# Altium schematic sheet NIXIE_Mainboard.SchDoc
size A3
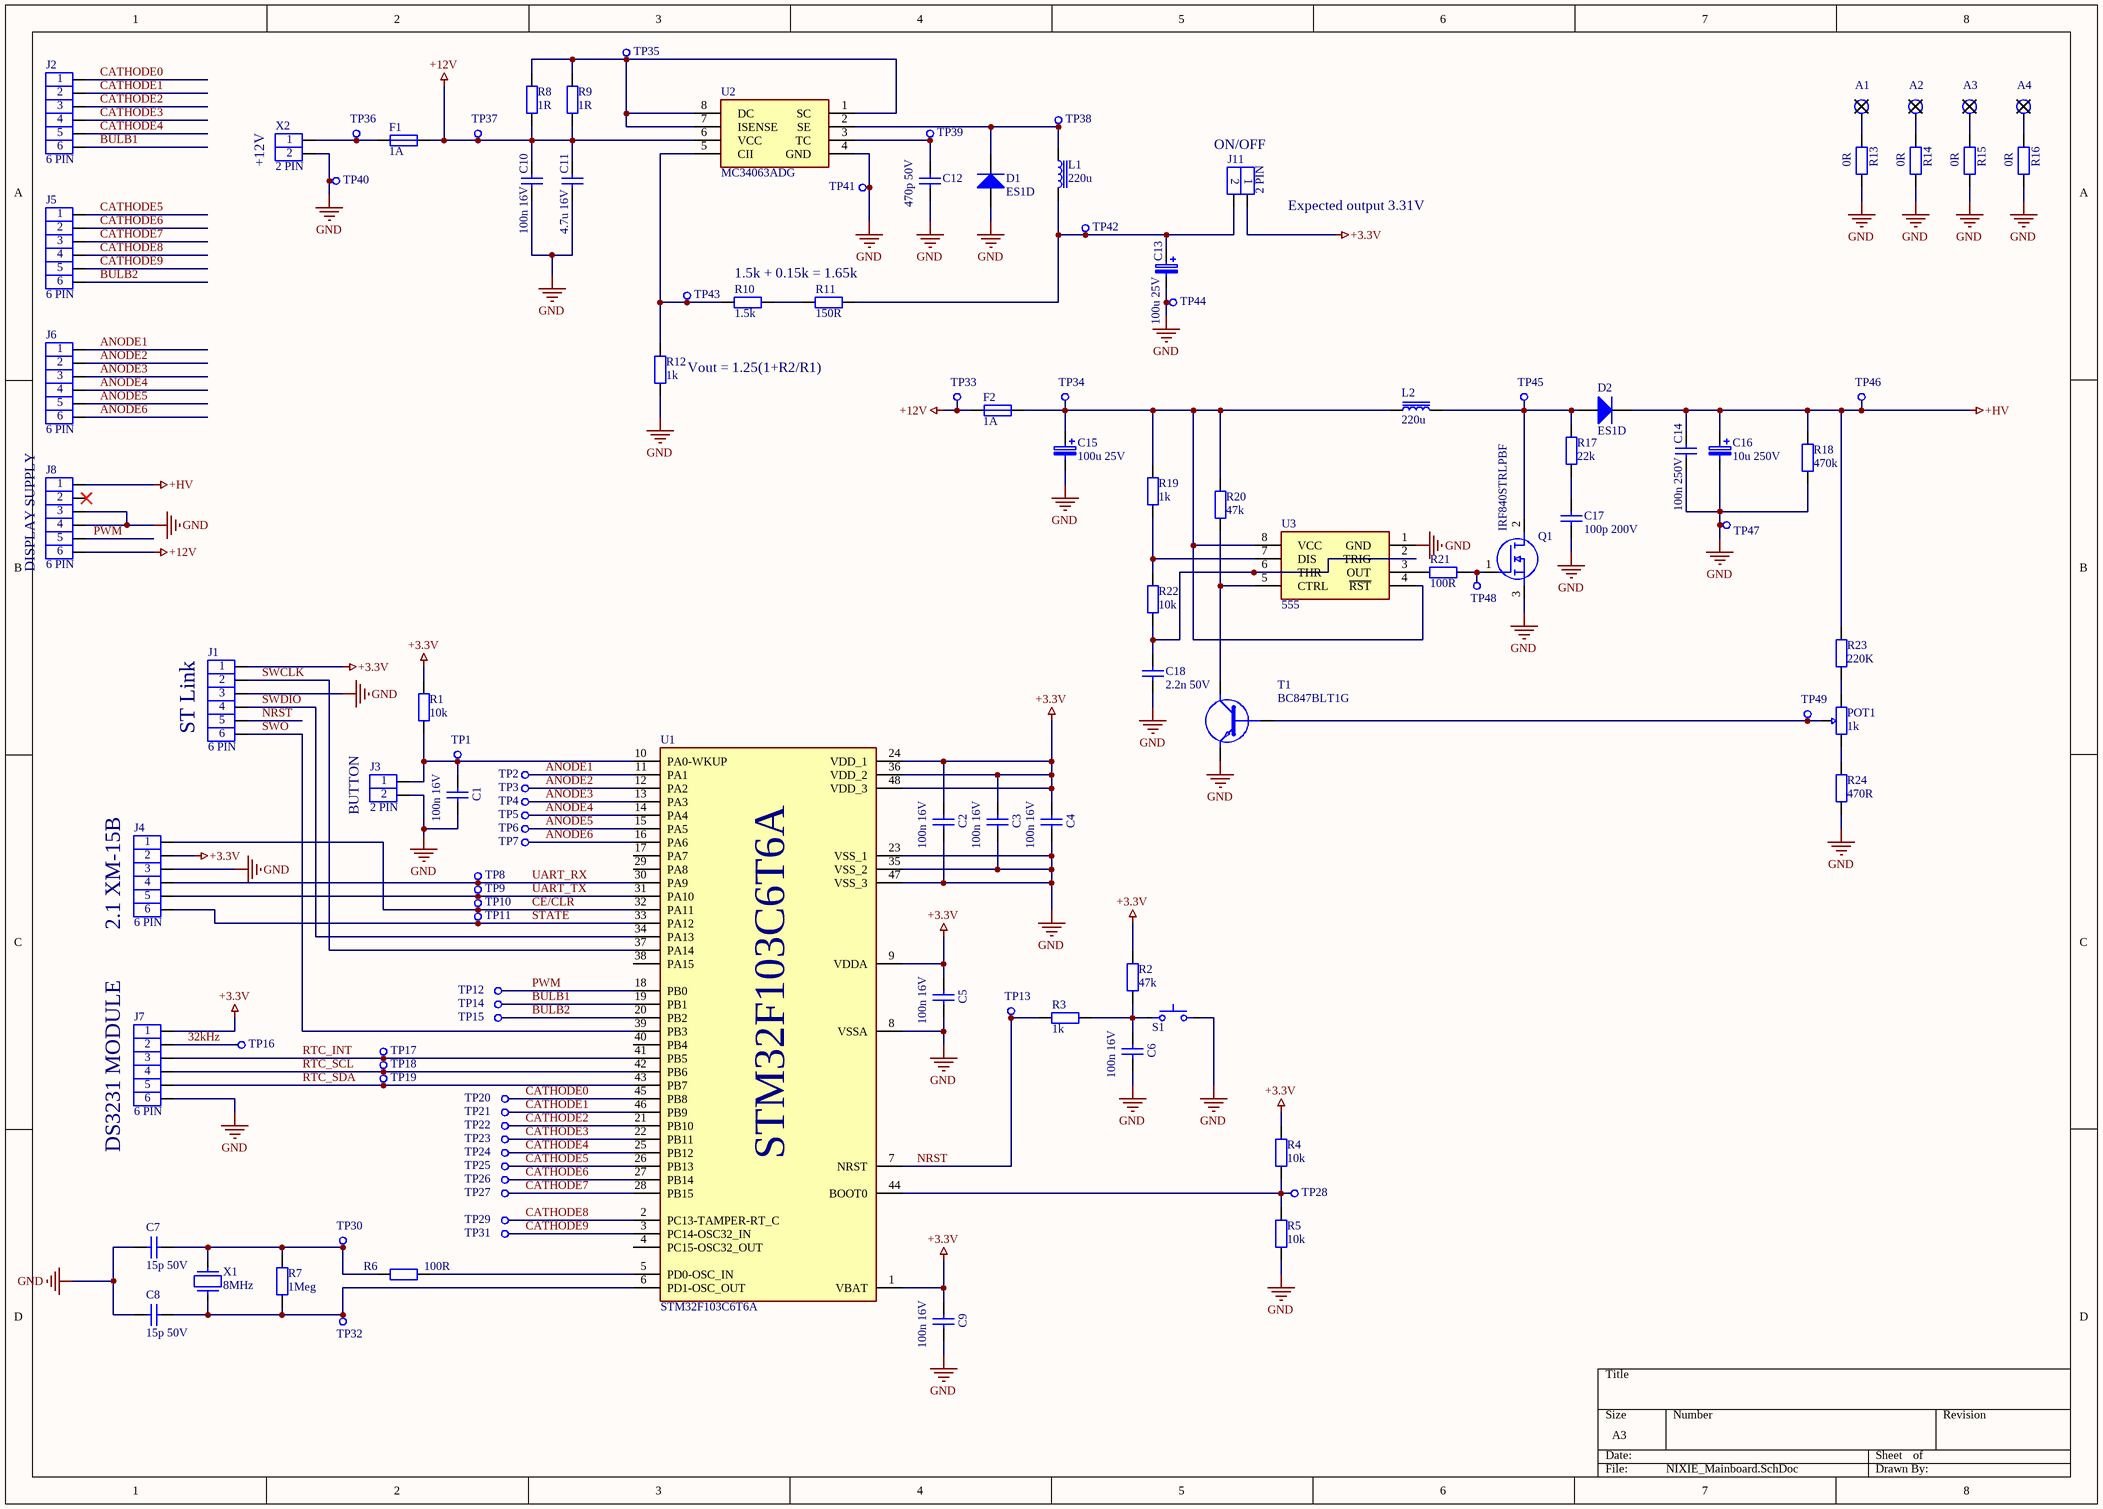
[diagram p0: NIXIE_Mainboard.SchDoc]

## Parts
A1  3mm  [HOLE M3]  (value not drawn)
A2  3mm  [HOLE M3]  (value not drawn)
A3  3mm  [HOLE M3]  (value not drawn)
A4  3mm  [HOLE M3]  (value not drawn)
C1  100n 16V  [CAPACITOR 0603]
C2  100n 16V  [CAPACITOR 0603]
C3  100n 16V  [CAPACITOR 0603]
C4  100n 16V  [CAPACITOR 0603]
C5  100n 16V  [CAPACITOR 0603]
C6  100n 16V  [CAPACITOR 0603]
C7  15p 50V  [CAPACITOR 0603]
C8  15p 50V  [CAPACITOR 0603]
C9  100n 16V  [CAPACITOR 0603]
C10  100n 16V  [CAPACITOR 0603]
C11  4.7u 16V  [CAPACITOR 0805]
C12  470p 50V  [CAPACITOR 0603]
C13  100u 25V  [CAPACITOR 6.3X11MM THT]
C14  100n 250V  [CAPACITOR 1206]
C15  100u 25V  [CAPACITOR 6.3X11MM THT]
C16  10u 250V  [CAPACITOR 10X20MM THT]
C17  100p 200V  [CAPACITOR 1206]
C18  2.2n 50V  [CAPACITOR 0603]
D1  ES1D  [DIODE DO-214AC]
D2  ES1D  [DIODE DO-214AC]
F1  1A  [FUSE 1206]
F2  1A  [FUSE 1206]
J1  6 PIN  [MECHANICAL PINHEADER 6P 2.54MM MALE]
J2  6 PIN  [MECHANICAL PINHEADER 6P 2.54MM MALE]
J3  2 PIN  [MECHANICAL PINHEADER 2P 2.54MM MALE]
J4  6 PIN  [MECHANICAL PINHEADER 6P 2.54MM MALE]
J5  6 PIN  [MECHANICAL PINHEADER 6P 2.54MM MALE]
J6  6 PIN  [MECHANICAL PINHEADER 6P 2.54MM MALE]
J7  6 PIN  [MECHANICAL PINHEADER 6P 2.54MM MALE]
J8  6 PIN  [MECHANICAL PINHEADER 6P 2.54MM MALE]
J11  2 PIN  [MECHANICAL PINHEADER 2P 2.54MM MALE]
L1  220u  [INDUCTOR CDRH127]
L2  220u  [INDUCTOR CDRH127]
POT1  1k  [POTENTIOMETER TC33X]
Q1  IRF840STRLPBF  [TO-263-3]
R1  10k  [RESISTOR 0603]
R2  47k  [RESISTOR 0603]
R3  1k  [RESISTOR 0603]
R4  10k  [RESISTOR 0603]
R5  10k  [RESISTOR 0603]
R6  100R  [RESISTOR 0603]
R7  1Meg  [RESISTOR 0603]
R8  1R  [RESISTOR 1206]
R9  1R  [RESISTOR 1206]
R10  1.5k  [RESISTOR 0603]
R11  150R  [RESISTOR 0603]
R12  1k  [RESISTOR 0603]
R13  0R  [RESISTOR 0603]
R14  0R  [RESISTOR 0603]
R15  0R  [RESISTOR 0603]
R16  0R  [RESISTOR 0603]
R17  22k  [RESISTOR 1206]
R18  470k  [RESISTOR 1206]
R19  1k  [RESISTOR 0603]
R20  47k  [RESISTOR 0603]
R21  100R  [RESISTOR 0603]
R22  10k  [RESISTOR 0603]
R23  220K  [RESISTOR 1206]
R24  470R  [RESISTOR 0603]
S1  6x6mm  [MECHANICAL TACTSWITCH SMD 6x6]  (value not drawn)
T1  BC847BLT1G  [SOT23-3]
TP1  1mm  [TEST POINT 1MM]  (value not drawn)
TP2  1mm  [TEST POINT 1MM]  (value not drawn)
TP3  1mm  [TEST POINT 1MM]  (value not drawn)
TP4  1mm  [TEST POINT 1MM]  (value not drawn)
TP5  1mm  [TEST POINT 1MM]  (value not drawn)
TP6  1mm  [TEST POINT 1MM]  (value not drawn)
TP7  1mm  [TEST POINT 1MM]  (value not drawn)
TP8  1mm  [TEST POINT 1MM]  (value not drawn)
TP9  1mm  [TEST POINT 1MM]  (value not drawn)
TP10  1mm  [TEST POINT 1MM]  (value not drawn)
TP11  1mm  [TEST POINT 1MM]  (value not drawn)
TP12  1mm  [TEST POINT 1MM]  (value not drawn)
TP13  1mm  [TEST POINT 1MM]  (value not drawn)
TP14  1mm  [TEST POINT 1MM]  (value not drawn)
TP15  1mm  [TEST POINT 1MM]  (value not drawn)
TP16  1mm  [TEST POINT 1MM]  (value not drawn)
TP17  1mm  [TEST POINT 1MM]  (value not drawn)
TP18  1mm  [TEST POINT 1MM]  (value not drawn)
TP19  1mm  [TEST POINT 1MM]  (value not drawn)
TP20  1mm  [TEST POINT 1MM]  (value not drawn)
TP21  1mm  [TEST POINT 1MM]  (value not drawn)
TP22  1mm  [TEST POINT 1MM]  (value not drawn)
TP23  1mm  [TEST POINT 1MM]  (value not drawn)
TP24  1mm  [TEST POINT 1MM]  (value not drawn)
TP25  1mm  [TEST POINT 1MM]  (value not drawn)
TP26  1mm  [TEST POINT 1MM]  (value not drawn)
TP27  1mm  [TEST POINT 1MM]  (value not drawn)
TP28  1mm  [TEST POINT 1MM]  (value not drawn)
TP29  1mm  [TEST POINT 1MM]  (value not drawn)
TP30  1mm  [TEST POINT 1MM]  (value not drawn)
TP31  1mm  [TEST POINT 1MM]  (value not drawn)
TP32  1mm  [TEST POINT 1MM]  (value not drawn)
TP33  1mm  [TEST POINT 1MM]  (value not drawn)
TP34  1mm  [TEST POINT 1MM]  (value not drawn)
TP35  1mm  [TEST POINT 1MM]  (value not drawn)
TP36  1mm  [TEST POINT 1MM]  (value not drawn)
TP37  1mm  [TEST POINT 1MM]  (value not drawn)
TP38  1mm  [TEST POINT 1MM]  (value not drawn)
TP39  1mm  [TEST POINT 1MM]  (value not drawn)
TP40  1mm  [TEST POINT 1MM]  (value not drawn)
TP41  1mm  [TEST POINT 1MM]  (value not drawn)
TP42  1mm  [TEST POINT 1MM]  (value not drawn)
TP43  1mm  [TEST POINT 1MM]  (value not drawn)
TP44  1mm  [TEST POINT 1MM]  (value not drawn)
TP45  1mm  [TEST POINT 1MM]  (value not drawn)
TP46  1mm  [TEST POINT 1MM]  (value not drawn)
TP47  1mm  [TEST POINT 1MM]  (value not drawn)
TP48  1mm  [TEST POINT 1MM]  (value not drawn)
TP49  1mm  [TEST POINT 1MM]  (value not drawn)
U1  STM32F103C6T6A  [LQFP-48]
U2  MC34063ADG  [SOIC-8]
U3  555  [SOIC-8]
X1  8MHz  [OSCILLATOR 8MHZ SMD]
X2  2 PIN  [MECHANICAL ARK KF301 2PIN]

## Nets
+3.3V: C2.2 C3.2 C4.2 C5.2 C9.2 J1.1 J4.2 J7.1 J11.1 R1.2 R2.2 R4.2 U1.1(VBAT) U1.9(VDDA) U1.24(VDD_1) U1.36(VDD_2) U1.48(VDD_3)
+12V: C10.2 C11.2 F1.2 F2.1 J8.6 R8.1 R9.1 TP33.1 TP37.1 U2.6(VCC)
+HV: C14.2 C16.1 D2.2 J8.1 R18.2 R23.2 TP46.1
GND: C1.1 C2.1 C3.1 C4.1 C5.1 C6.1 C7.1 C8.1 C9.1 C10.1 C11.1 C12.1 C13.2 C14.1 C15.2 C16.2 C17.1 C18.1 D1.1 J1.3 J3.2 J4.3 J7.6 J8.3 J8.4 Q1.3(S) R5.1 R12.1 R13.1 R14.1 R15.1 R16.1 R18.1 R24.1 S1.2 T1.2(E) TP40.1 TP41.1 TP44.1 TP47.1 U1.8(VSSA) U1.23(VSS_1) U1.35(VSS_2) U1.47(VSS_3) U2.4(GND) U3.1(GND) X2.2
32kHz: J7.2 TP16.1
ANODE1: J6.1 TP2.1 U1.11(PA1)
ANODE2: J6.2 TP3.1 U1.12(PA2)
ANODE3: J6.3 TP4.1 U1.13(PA3)
ANODE4: J6.4 TP5.1 U1.14(PA4)
ANODE5: J6.5 TP6.1 U1.15(PA5)
ANODE6: J6.6 TP7.1 U1.16(PA6)
BULB1: J2.6 TP14.1 U1.19(PB1)
BULB2: J5.6 TP15.1 U1.20(PB2)
CATHODE0: J2.1 TP20.1 U1.45(PB8)
CATHODE1: J2.2 TP21.1 U1.46(PB9)
CATHODE2: J2.3 TP22.1 U1.21(PB10)
CATHODE3: J2.4 TP23.1 U1.22(PB11)
CATHODE4: J2.5 TP24.1 U1.25(PB12)
CATHODE5: J5.1 TP25.1 U1.26(PB13)
CATHODE6: J5.2 TP26.1 U1.27(PB14)
CATHODE7: J5.3 TP27.1 U1.28(PB15)
CATHODE8: J5.4 TP29.1 U1.2(PC13-TAMPER-RT_C)
CATHODE9: J5.5 TP31.1 U1.3(PC14-OSC32_IN)
CE/CLR: J4.1 TP10.1 U1.32(PA11)
NRST: J1.5 R3.2 TP13.1 U1.7(NRST)
PWM: J8.5 TP12.1 U1.18(PB0)
RTC_INT: J7.3 TP17.1 U1.41(PB5)
RTC_SCL: J7.4 TP18.1 U1.42(PB6)
RTC_SDA: J7.5 TP19.1 U1.43(PB7)
STATE: J4.6 TP11.1 U1.33(PA12)
SWCLK: J1.2 U1.37(PA14)
SWDIO: J1.4 U1.34(PA13)
SWO: J1.6 U1.39(PB3)
UART_RX: J4.4 TP8.1 U1.30(PA9)
UART_TX: J4.5 TP9.1 U1.31(PA10)
NetA1_1: A1.1 R13.2
NetA2_1: A2.1 R14.2
NetA3_1: A3.1 R15.2
NetA4_1: A4.1 R16.2
NetC1_2: C1.2 J3.1 R1.1 TP1.1 U1.10(PA0-WKUP)
NetC6_2: C6.2 R2.1 R3.1 S1.1
NetC7_2: C7.2 R6.1 R7.2 TP30.1 X1.2
NetC8_2: C8.2 R7.1 TP32.1 U1.6(PD1-OSC_OUT) X1.1
NetC12_2: C12.2 TP39.1 U2.3(TC)
NetC13_1: C13.1 J11.2 L1.1 R11.2 TP42.1
NetC15_1: C15.1 F2.2 L2.1 R19.2 R20.2 TP34.1 U3.4(~{RST}) U3.8(VCC)
NetC17_2: C17.2 R17.1
NetC18_2: C18.2 R22.1 U3.2(TRIG) U3.6(THR)
NetD1_2: D1.2 L1.2 TP38.1 U2.2(SE)
NetD2_1: D2.1 L2.2 Q1.2(D) R17.2 TP45.1
NetF1_1: F1.1 TP36.1 X2.1
NetPOT1_1: POT1.1 R23.1
NetPOT1_2: POT1.2 T1.1(B) TP49.1
NetPOT1_3: POT1.3 R24.2
NetQ1_1: Q1.1(G) R21.2 TP48.1
NetR4_1: R4.1 R5.2 TP28.1 U1.44(BOOT0)
NetR6_2: R6.2 U1.5(PD0-OSC_IN)
NetR8_2: R8.2 R9.2 TP35.1 U2.1(SC) U2.7(ISENSE) U2.8(DC)
NetR10_1: R10.1 R12.2 TP43.1 U2.5(CII)
NetR10_2: R10.2 R11.1
NetR19_1: R19.1 R22.2 U3.7(DIS)
NetR20_1: R20.1 T1.3(C) U3.5(CTRL)
NetR21_1: R21.1 U3.3(OUT)

Not connected (* = marked no-connect by the designer): J8 2*; U1 4(PC15-OSC32_OUT) 17(PA7) 29(PA8) 38(PA15) 40(PB4)

## Notes on the sheet
- (near X2) +12V
- (near J11) ON/OFF
- (near J11) Expected output 3.31V
- 1.5k + 0.15k = 1.65k
- (near R12) Vout = 1.25(1+R2/R1)
- (near J8) DISPLAY SUPPLY
- (near J1) ST Link
- (near J3) BUTTON
- (near J4) 2.1 XM-15B
- (near J7) DS3231 MODULE

## Library data of the parts
A1-A4 = Mechanical M3 Hole: ComponentLink1Description: Datasheet; ComponentLink1URL: -; Manufacturer: -; Manufacturer Part Number: -; Footprint: -; Price 10pcs [$]: -; Supplier: -
C1-C6 C9 C10 = Capacitor 100n 16V 10% X7R 0603: Multilayer Ceramic Capacitors MLCC - SMD/SMT 0603 16VDC 0.1uF 10% X7R; Manufacturer: Taiyo Yuden; Manufacturer Part Number: EMK107B7104KA-T; ComponentLink1Description: Datasheet; ComponentLink1URL: https://www.mouser.pl/datasheet/2/396/mlcc02_e-1307760.pdf; Footprint: Capacitor 0603; Price 10pcs [$]: 0.016; Supplier: Mouser
C7 C8 = Capacitor 15p 50V 10% X7R 0603: Multilayer Ceramic Capacitors MLCC - SMD/SMT 50 V 15 pF C0G 0603 5%; Manufacturer: YAGEO; Manufacturer Part Number: CC0603JPNPO9BN150; ComponentLink1Description: Datasheet; ComponentLink1URL: https://www.mouser.pl/datasheet/2/447/UPY_NP0X5R_01005_4V_to_25V_V10-3003057.pdf; Footprint: Capacitor 0603; Price 10pcs [$]: 0.024; Supplier: Mouser
C11 = Capacitor 4.7u 16V 10% X7R 0805: Multilayer Ceramic Capacitors MLCC - SMD/SMT 0805 16VDC 4.7uF 10% X7R; Manufacturer: Taiyo Yuden; Manufacturer Part Number: EMK212B7475KG-T; ComponentLink1Description: Datasheet; ComponentLink1URL: https://www.mouser.pl/datasheet/2/396/mlcc02_e-1307760.pdf; Footprint: Capacitor 0805; Price 10pcs [$]: 0.114; Supplier: Mouser
C12 = Capacitor 470p 50V 10% X7R 0603: Multilayer Ceramic Capacitors MLCC - SMD/SMT 470p +-10% 16VX7R; Manufacturer: Walsin; Manufacturer Part Number: CC0603KPX7R9BB471; ComponentLink1Description: Datasheet; ComponentLink1URL: https://www.mouser.pl/datasheet/2/447/UPY_NP0X5R_01005_4V_to_25V_V10-3003057.pdf; Footprint: Capacitor 0603; Price 10pcs [$]: 0.065; Supplier: Mouser
C13 C15 = Capacitor 100u 25V 20% Aluminum 6.3x11mm THT: Aluminum Electrolytic Capacitors - Radial Leaded 25V 100uF 105C 6.3x11mm; Manufacturer: Lelon; Manufacturer Part Number: RGA101M1EBK-0611G; ComponentLink1Description: Datasheet; ComponentLink1URL: https://www.mouser.pl/datasheet/2/231/161587830771-2307470.pdf; Footprint: Capacitor 6.3x11mm THT; Price 10pcs [$]: 0.119; Supplier: Mouser
C14 = Capacitor 100n 250V 5% X7R 1206: Multilayer Ceramic Capacitors MLCC - SMD/SMT 250V 1000pF X7R 1206 5% Flex Term; Manufacturer: KEMET; Manufacturer Part Number: C1206X102JARACTU; ComponentLink1Description: Datasheet; ComponentLink1URL: https://www.mouser.pl/datasheet/2/212/KEM_C1011_X7R_TIP_RING_SMD-1103951.pdf; Footprint: Capacitor 1206; Price 10pcs [$]: 0.532; Supplier: Mouser
C16 = Capacitor 10u 250V 20% Aluminum 10x20mm THT: Aluminum Electrolytic Capacitors - Radial Leaded 25V 100uF 105C 6.3x11mm; Manufacturer: Producent; Manufacturer Part Number: PJ2E100MNN1020; ComponentLink1Description: Datasheet; ComponentLink1URL: https://www.tme.eu/Document/f817dd3cf02528febed7ff40ffb84e0e/PART-NUMBER-SYSTEM.pdf; Price 10pcs [$]: 0.215; Supplier: TME
C17 = Capacitor 100p 200V 10% X7R 1206: Multilayer Ceramic Capacitors MLCC - SMD/SMT 200V 100pF X7R 1206 10% AEC-Q200; Manufacturer: KEMET; Manufacturer Part Number: C1206C101K2RACAUTO; ComponentLink1Description: Datasheet; ComponentLink1URL: https://www.mouser.pl/datasheet/2/212/KEM_C1023_X7R_AUTO_SMD-1093309.pdf; Footprint: Capacitor 1206; Price 10pcs [$]: 0.338; Supplier: MOUSER
C18 = Capacitor 2.2n 50V 10% X7R 0603: Multilayer Ceramic Capacitors MLCC - SMD/SMT 0603 50VDC 2200pF 10% X7R AEC-Q200; Manufacturer: Taiyo Yuden; Manufacturer Part Number: UMK107B7222KAHT; ComponentLink1Description: Datasheet; ComponentLink1URL: https://www.mouser.pl/datasheet/2/396/taiyo_yuden_12132018_mlcc11_hq_e-1510082.pdf; Footprint: Capacitor 0603; Price 10pcs [$]: 0.09; Supplier: Mouser
D1 D2 = Diode 200V 1.5W 1A Rectifier Vf 920mV ES1D: Rectifiers 1.0a Rectifier UF Recovery; Manufacturer: onsemi / Fairchild; Manufacturer Part Number: ES1D; Price 10pcs [$]: 0.383; Supplier: Mouser; ComponentLink1Description: Datasheet; ComponentLink1URL: https://www.mouser.pl/datasheet/2/308/ES1D_D-1805714.pdf
F1 F2 = Fuse 1A 1% 1/4W 1206: Surface Mount Fuses 1A 63V TIME DELAY; Manufacturer: Bourns; Manufacturer Part Number: SF-1206HI100M-2; ComponentLink1Description: Datasheet; ComponentLink1URL: https://www.mouser.pl/datasheet/2/54/sf_1206hi_m-1366413.pdf; Footprint: Fuse 1206; Price 10pcs [$]: 0.681; Supplier: Mouser
J1 J2 J4-J8 = Mechanical Pinheader Male 6pin P=2.54mm THT: Headers & Wire Housings 2.54MM CGRIDIII HDR 6P VERT SR SEL AU; Manufacturer: Molex; Manufacturer Part Number: 90120-0766; ComponentLink1Description: Datasheet; ComponentLink1URL: https://www.mouser.pl/datasheet/2/276/3/0901200765_PCB_HEADERS-2849265.pdf; Price 10pcs [$]: 1.65; Supplier: Mouser
J3 J11 = Mechanical Pinheader Male 2pin P=2.54mm THT: Headers & Wire Housings 2.54MM CGRIDIII HDR 2P VERT SR SEL AU; Manufacturer: Molex; Manufacturer Part Number: 90120-0762; ComponentLink1Description: Datasheet; ComponentLink1URL: https://www.mouser.pl/datasheet/2/276/3/0901200765_PCB_HEADERS-2849265.pdf; Price 10pcs [$]: 0.593; Supplier: Mouser
L1 L2 = Inductor 220uH 0.95A Shielded 49221C: Power Inductors - SMD 220uH 0.95A Dual wind inductor; Manufacturer: Murata Power Solutions; Manufacturer Part Number: 49221C; ComponentLink1Description: Datasheet; ComponentLink1URL: https://www.mouser.pl/datasheet/2/281/1/kmp_4800-2936266.pdf; Price 10pcs [$]: 1.36; Supplier: Mouser
POT1 = Potentiometer PCB 1k SMD TC33X-1-102E: Trimmer Resistors - SMD TRIMMER-3MM OPEN FRAME; Manufacturer: Bourns; ComponentLink1Description: Datasheet; ComponentLink1URL: https://www.mouser.pl/datasheet/2/54/tc33-778219.pdf; Manufacturer Part Number: TC33X-1-102E; Price 10pcs [$]: 0.275; Supplier: Mouser
Q1 = Transistor N-MOSFET 500V 8A TO-263-3 IRF840STRLPBF: MOSFET 500V N-CH HEXFET D2-PA; Manufacturer: Vishay Semiconductors; Manufacturer Part Number: IRF840STRLPBF; Supplier: Mouser; Price 10pcs [$]: 2.57; ComponentLink1Description: Datasheet; ComponentLink1URL: https://www.mouser.pl/datasheet/2/427/sihf840s-1768741.pdf
R1 R4 R5 R22 = Resistor 10k 1% 1/10W 0603: Thin Film Resistors - SMD 1/10W 10K ohm 1% 50ppm; Manufacturer: Yageo; Manufacturer Part Number: RT0603FRE1310KL; ComponentLink1Description: Datasheet; ComponentLink1URL: https://www.mouser.pl/datasheet/2/447/PYu_RT_1_to_0_01_RoHS_L_12-3003070.pdf; Footprint: Resistor 0603; Price 10pcs [$]: 0.057; Supplier: Mouser
R2 R20 = Resistor 47k 1% 1/10W 0603: Thin Film Resistors - SMD 1/10W 47K ohm 1% 50ppm; Manufacturer: Yageo; Manufacturer Part Number: RT0603FRE1347KL; ComponentLink1Description: Datasheet; ComponentLink1URL: https://www.mouser.pl/datasheet/2/447/PYu_RT_1_to_0_01_RoHS_L_12-3003070.pdf; Footprint: Resistor 0603; Price 10pcs [$]: 0.057; Supplier: Mouser
R3 R12 R19 = Resistor 1k 1% 1/10W 0603: Thin Film Resistors - SMD 1/10W 1K ohm 1% 50ppm; Manufacturer: Yageo; Manufacturer Part Number: RT0603FRE071KL; ComponentLink1Description: Datasheet; ComponentLink1URL: https://www.mouser.pl/datasheet/2/447/PYu_RT_1_to_0_01_RoHS_L_12-3003070.pdf; Footprint: Resistor 0603; Price 10pcs [$]: 0.057; Supplier: Mouser
R6 R21 = Resistor 100R 1% 1/10W 0603: Thin Film Resistors - SMD 1/10W 100R ohm 1% 50ppm; Manufacturer: Yageo; Manufacturer Part Number: RT0603FRE07100RL; ComponentLink1Description: Datasheet; ComponentLink1URL: https://www.mouser.pl/datasheet/2/447/PYu_RT_1_to_0_01_RoHS_L_12-3003070.pdf; Footprint: Resistor 0603; Price 10pcs [$]: 0.057; Supplier: Mouser
R7 = Resistor 1Meg 1% 1/10W 0603: Thin Film Resistors - SMD 1/10W 1M ohm 1% 50ppm; Manufacturer: Yageo; Manufacturer Part Number: RT0603FRE071ML; ComponentLink1Description: Datasheet; ComponentLink1URL: https://www.mouser.pl/datasheet/2/447/PYu_RT_1_to_0_01_RoHS_L_12-3003070.pdf; Footprint: Resistor 0603; Price 10pcs [$]: 0.07; Supplier: Mouser
R8 R9 = Resistor 1R 1% 1/4W 1206: Thick Film Resistors - SMD 1 Ohms 250 mW 1206 1%; Manufacturer: Yageo; Manufacturer Part Number: RC1206FR-071RL; ComponentLink1Description: Datasheet; ComponentLink1URL: https://www.mouser.pl/datasheet/2/447/PYu_RC_Group_51_RoHS_L_11-1984063.pdf; Footprint: Resistor 0603; Price 10pcs [$]: 0.116; Supplier: Mouser
R10 = Resistor 1.5k 1% 1/10W 0603: Thin Film Resistors - SMD 1/10W 1.5K ohm 1% 50ppm; Manufacturer: Yageo; Manufacturer Part Number: RT0603FRE071K5L; ComponentLink1Description: Datasheet; ComponentLink1URL: https://www.mouser.pl/datasheet/2/447/PYu_RT_1_to_0_01_RoHS_L_12-3003070.pdf; Footprint: Resistor 0603; Price 10pcs [$]: 0.057; Supplier: Mouser
R11 = Resistor 150R 1% 1/10W 0603: Thin Film Resistors - SMD 1/10W 150R ohm 1% 50ppm; Manufacturer: Yageo; Manufacturer Part Number: RT0603FRE07150RL; ComponentLink1Description: Datasheet; ComponentLink1URL: https://www.mouser.pl/datasheet/2/447/PYu_RT_1_to_0_01_RoHS_L_12-3003070.pdf; Footprint: Resistor 0603; Price 10pcs [$]: 0.057; Supplier: Mouser
R13-R16 = Resistor 0R 1% 1/10W 0603: Thick Film Resistors - SMD 0 Ohms 100 mW 0603 5%; Manufacturer: Yageo; Manufacturer Part Number: RC0603JR-070RL; ComponentLink1Description: Datasheet; ComponentLink1URL: https://www.mouser.pl/datasheet/2/447/PYu_RC_Group_51_RoHS_L_11-1984063.pdf; Footprint: Resistor 0603; Price 10pcs [$]: 0.02; Supplier: Mouser
R17 = Resistor 22k 1% 1/4W 1206: Thin Film Resistors - SMD 1/4W 22 kohm 1% 50ppm; Manufacturer: Yageo; Manufacturer Part Number: RT1206FRE0722KL; ComponentLink1Description: Datasheet; ComponentLink1URL: https://www.mouser.pl/datasheet/2/447/PYu_RT_1_to_0_01_RoHS_L_12-3003070.pdf; Footprint: Resistor 1206; Price 10pcs [$]: 0.125; Supplier: Mouser
R18 = Resistor 470k 1% 1/4W 1206: Thin Film Resistors - SMD 1/4W470 kohm 1% 50ppm; Manufacturer: Yageo; Manufacturer Part Number: RT1206FRE07470KL; ComponentLink1Description: Datasheet; ComponentLink1URL: https://www.mouser.pl/datasheet/2/447/PYu_RT_1_to_0_01_RoHS_L_12-3003070.pdf; Footprint: Resistor 1206; Price 10pcs [$]: 0.125; Supplier: Mouser
R23 = Resistor 220k 1% 1/4W 1206: Thin Film Resistors - SMD 1/4W 220 kohm 1% 50ppm; Manufacturer: Yageo; Manufacturer Part Number: RT1206FRE07220KL; ComponentLink1Description: Datasheet; ComponentLink1URL: https://www.mouser.pl/datasheet/2/447/PYu_RT_1_to_0_01_RoHS_L_12-3003070.pdf; Footprint: Resistor 1206; Price 10pcs [$]: 0.125; Supplier: Mouser
R24 = Resistor 470R 1% 1/10W 0603: Thin Film Resistors - SMD 1/10W 470R ohm 1% 50ppm; Manufacturer: Yageo; Manufacturer Part Number: RT0603FRE07470RL; ComponentLink1Description: Datasheet; ComponentLink1URL: https://www.mouser.pl/datasheet/2/447/PYu_RT_1_to_0_01_RoHS_L_12-3003070.pdf; Footprint: Resistor 0603; Price 10pcs [$]: 0.057; Supplier: Mouser
S1 = Mechanical Tact Switch 6x6mm THT: Tactile Switches 6 x 6 mm, 5 mm Act Height, 260 gf, Black, Short Crimped, Through Hole, SPST; Manufacturer: CUI Devices; Manufacturer Part Number: TS02-66-50-BK-260-SCR-D; ComponentLink1Description: Datasheet; ComponentLink1URL: https://www.mouser.pl/datasheet/2/670/ts02-2586188.pdf; Price 10pcs [$]: 0.097; Supplier: Mouser
T1 = Transistor NPN 100mA 50V BC847BLT1G: Bipolar Transistors - BJT 100mA 50V NPN; Manufacturer: onsemi; Manufacturer Part Number: BC847BLT1G; Supplier: Mouser; Price 10pcs [$]: 0.094; ComponentLink1Description: Datasheet; ComponentLink1URL: https://www.mouser.pl/datasheet/2/308/BC846ALT1_D-1387679.pdf
TP1-TP49 = Mechanical Test Point 1mm: Tesp Point 1mm; ComponentLink1Description: Datasheet; ComponentLink1URL: -; Manufacturer: -; Manufacturer Part Number: -; Footprint: -; Price 10pcs [$]: -; Supplier: -
U1 = IC MCU ARM M3 STM32F103C6T6A: ARM Microcontrollers - MCU 32BIT Cortex M3 L/D Performance LINE; Manufacturer: STMicroelectronics; ComponentLink1Description: Datasheet; ComponentLink1URL: https://www.mouser.pl/datasheet/2/389/stm32f103c4-1851082.pdf; Manufacturer Part Number: STM32F103C6T6A; Price 10pcs [$]: 6.64; Supplier: Mouser
U2 = IC Switching Voltage Regulator SOIC-8 40V 1.5A MC34063ADG: LDO Voltage Regulators 45V Vin, 100mA, Low Noise, Low Dropout, Micropower Linear Regulator; Manufacturer: onsemi; Manufacturer Part Number: MC34063ADG; Price 10pcs [$]: 0.531; Supplier: Mouser; ComponentLink1Description: Datasheet; ComponentLink1URL: https://www.mouser.pl/datasheet/2/308/MC34063A_D-1811395.pdf
U3 = IC Timer Module 555 SO-8: Timers & Support Products Precision; Manufacturer: Texas Instruments; Manufacturer Part Number: NE555DR; ComponentLink1Description: Datasheet; ComponentLink1URL: https://www.ti.com/general/docs/suppproductinfo.tsp?distId=26&gotoUrl=https://www.ti.com/lit/gpn/se555m; Price 10pcs [$]: 0.196; Supplier: TME
X1 = Crystal 8MHz 20p SMD: Crystals CRYSTAL 8.0000MHZ 20PF SMD; Manufacturer: ABRACON; Manufacturer Part Number: ABLS-8.000MHZ-20-B-3-H-T; ComponentLink1Description: Datasheet; ComponentLink1URL: https://www.mouser.pl/datasheet/2/3/abls-1664338.pdf; Price 10pcs [$]: 0.129; Supplier: Mouser
X2 = Mechanical ARK Terminal Block 2pin P=5mm THT: Fixed Terminal Blocks 2 24 Poles, Screw Type, Horizontal, 5.0 Pitch, 26 14 (AWG), Terminal Block Connector; Manufacturer: CUI Devices; Manufacturer Part Number: TB003-500-P02BE; ComponentLink1Description: Datasheet; ComponentLink1URL: https://www.mouser.pl/datasheet/2/670/tb003_500-2306959.pdf; Price 10pcs [$]: 0.252; Supplier: Mouser